# EAGLE design leddriverX3 (EAGLE 9.4.2)
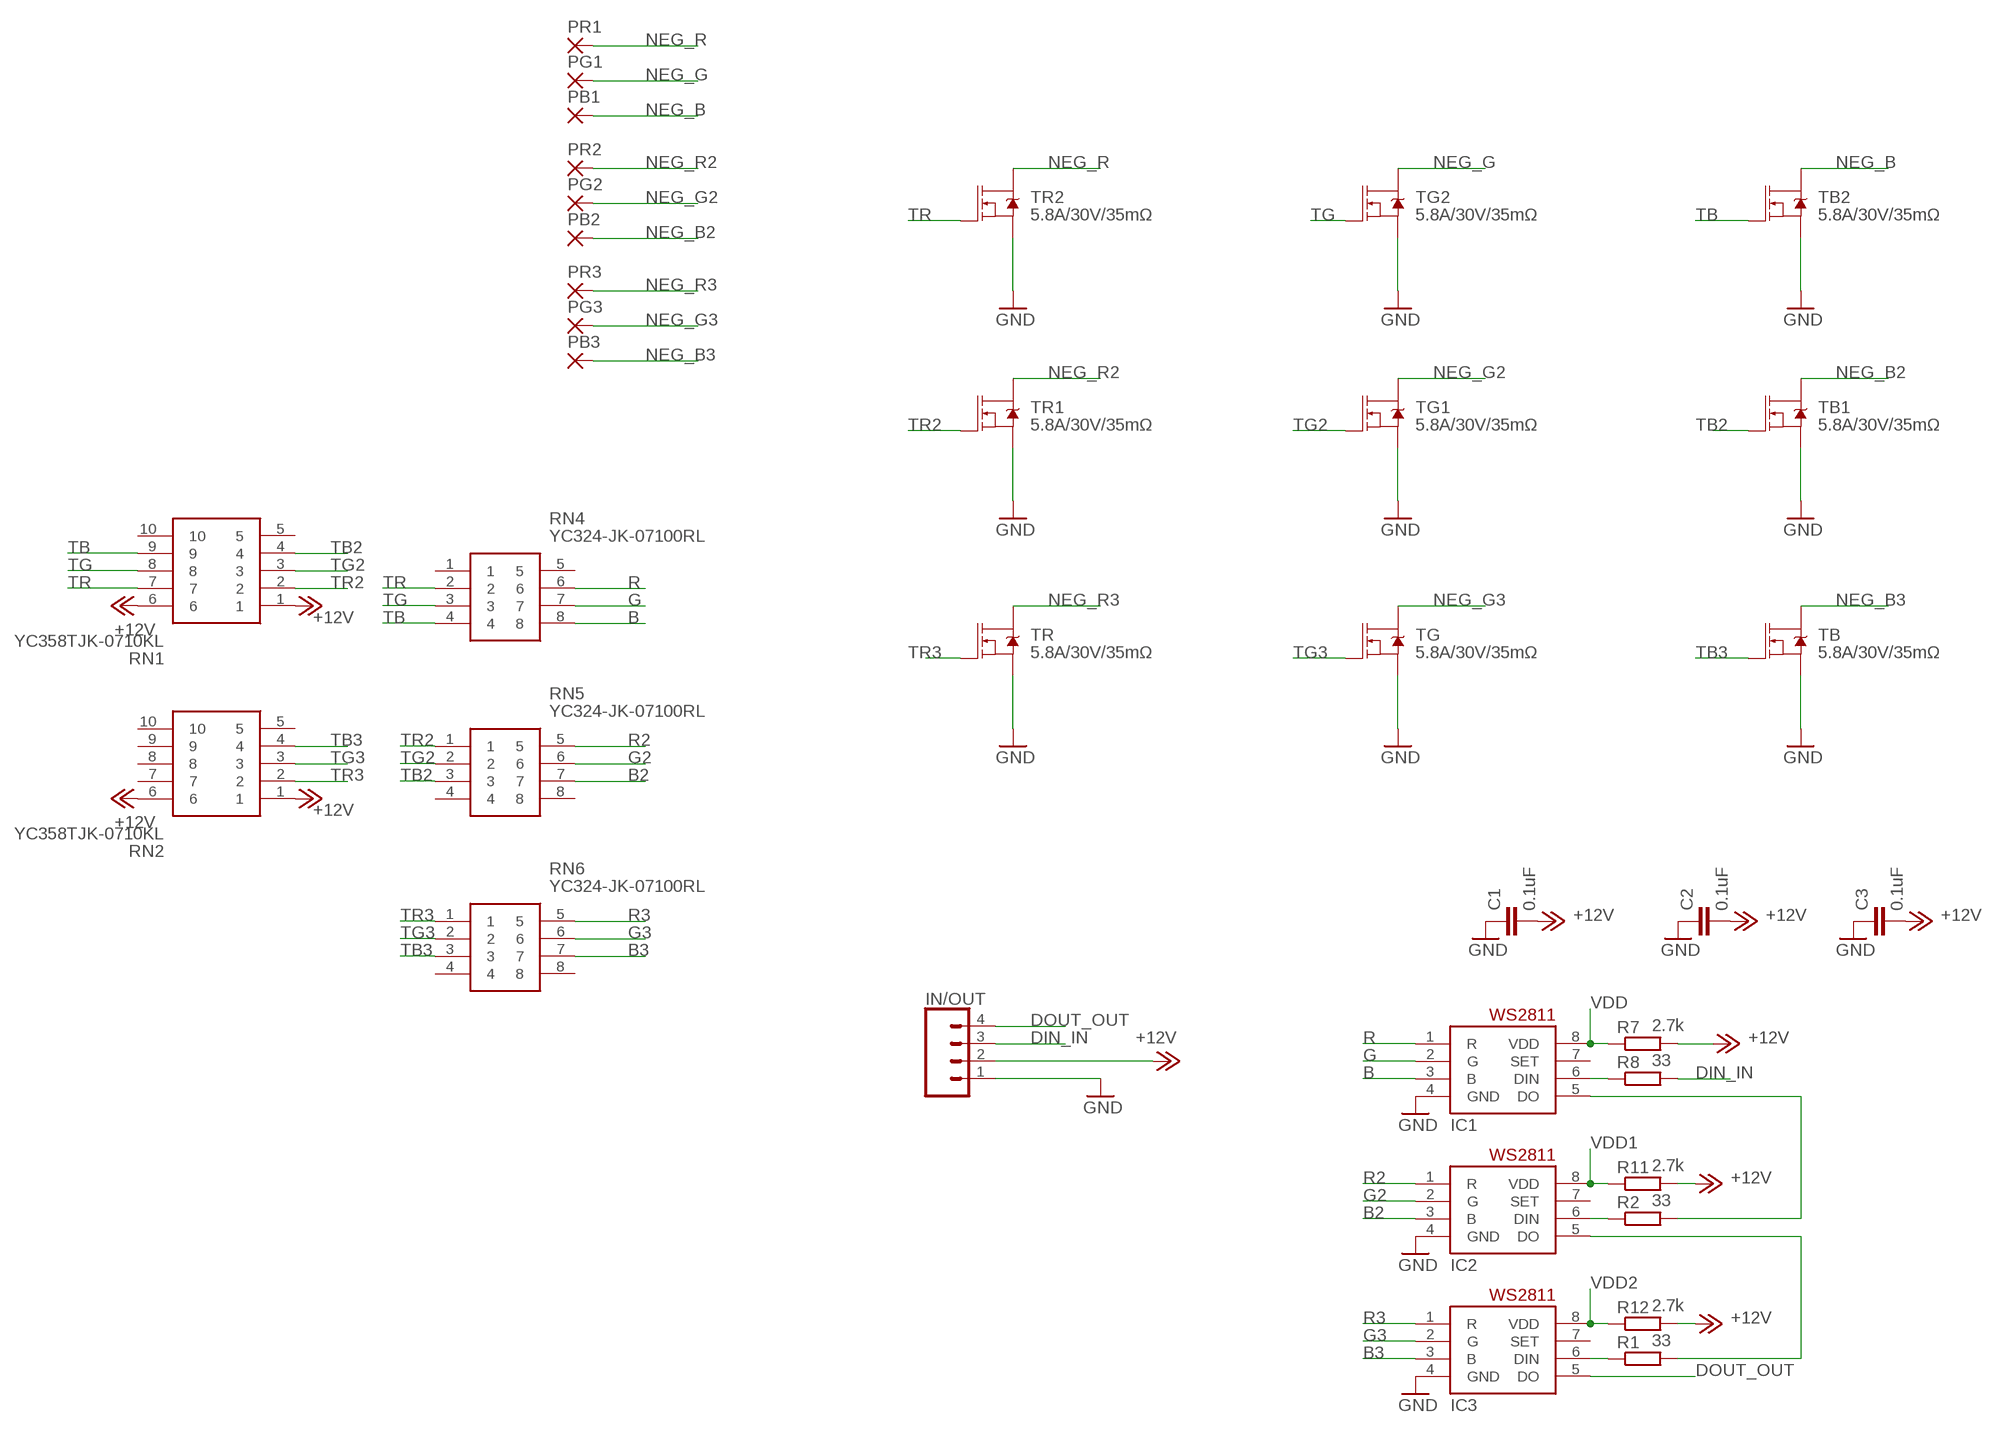
[diagram p0: schematic, sheet 1]

## Parts
C1  0.1uF  C-EUC1206  [C1206]
C2  0.1uF  C-EUC1206  [C1206]
C3  0.1uF  C-EUC1206  [C1206]
IC1  WS2811-SOP8  [SO08-SKINNYPADS]
IC2  WS2811-SOP8  [SO08-SKINNYPADS]
IC3  WS2811-SOP8  [SO08-SKINNYPADS]
IN/OUT  CONN_04LONGPADS  [1X04_LONGPADS]
PB1  3,81/1,4  [3,81/1,4]
PB2  3,81/1,4  [3,81/1,4]
PB3  3,81/1,4  [3,81/1,4]
PG1  3,81/1,4  [3,81/1,4]
PG2  3,81/1,4  [3,81/1,4]
PG3  3,81/1,4  [3,81/1,4]
PR1  3,81/1,4  [3,81/1,4]
PR2  3,81/1,4  [3,81/1,4]
PR3  3,81/1,4  [3,81/1,4]
R1  33  R-EU_R0805  [R0805]
R2  33  R-EU_R0805  [R0805]
R7  2.7k  R-EU_R0805  [R0805]
R8  33  R-EU_R0805  [R0805]
R11  2.7k  R-EU_R0805  [R0805]
R12  2.7k  R-EU_R0805  [R0805]
RN1  YC358TJK-0710KL  [YC358T]
RN2  YC358TJK-0710KL  [YC358T]
RN4  YC324-JK-07100RL  [YC324JK07100RL]
RN5  YC324-JK-07100RL  [YC324JK07100RL]
RN6  YC324-JK-07100RL  [YC324JK07100RL]
TB  5.8A/30V/35mΩ  MOSFET-NCH-AO3404A  [SOT23-3]
TB1  5.8A/30V/35mΩ  MOSFET-NCH-AO3404A  [SOT23-3]
TB2  5.8A/30V/35mΩ  MOSFET-NCH-AO3404A  [SOT23-3]
TG  5.8A/30V/35mΩ  MOSFET-NCH-AO3404A  [SOT23-3]
TG1  5.8A/30V/35mΩ  MOSFET-NCH-AO3404A  [SOT23-3]
TG2  5.8A/30V/35mΩ  MOSFET-NCH-AO3404A  [SOT23-3]
TR  5.8A/30V/35mΩ  MOSFET-NCH-AO3404A  [SOT23-3]
TR1  5.8A/30V/35mΩ  MOSFET-NCH-AO3404A  [SOT23-3]
TR2  5.8A/30V/35mΩ  MOSFET-NCH-AO3404A  [SOT23-3]

## Nets
+12V: C1.2 C2.2 C3.2 IN/OUT.2 R7.2 R11.2 R12.2 RN1.1 RN1.6 RN2.1 RN2.6
B: IC1.3(B) RN4.8
B2: IC2.3(B) RN5.7
B3: IC3.3(B) RN6.7
DIN_IN: IN/OUT.3 R8.2
DOUT_OUT: IC3.5(DO) IN/OUT.4
G: IC1.2(G) RN4.7
G2: IC2.2(G) RN5.6
G3: IC3.2(G) RN6.6
GND: C1.1 C2.1 C3.1 IC1.4(GND) IC2.4(GND) IC3.4(GND) IN/OUT.1 TB1.2(S) TB2.2(S) TB.2(S) TG1.2(S) TG2.2(S) TG.2(S) TR1.2(S) TR2.2(S) TR.2(S)
N$1: IC1.6(DIN) R8.1
N$5: IC1.5(DO) R2.2
N$11: IC2.5(DO) R1.2
N$13: IC3.6(DIN) R1.1
N$14: IC2.6(DIN) R2.1
NEG_B: PB1.1(P) TB2.3(D)
NEG_B2: PB2.1(P) TB1.3(D)
NEG_B3: PB3.1(P) TB.3(D)
NEG_G: PG1.1(P) TG2.3(D)
NEG_G2: PG2.1(P) TG1.3(D)
NEG_G3: PG3.1(P) TG.3(D)
NEG_R: PR1.1(P) TR2.3(D)
NEG_R2: PR2.1(P) TR1.3(D)
NEG_R3: PR3.1(P) TR.3(D)
R: IC1.1(R) RN4.6
R2: IC2.1(R) RN5.5
R3: IC3.1(R) RN6.5
TB: RN1.9 RN4.4 TB2.1(G)
TB2: RN1.4 RN5.3 TB1.1(G)
TB3: RN2.4 RN6.3 TB.1(G)
TG: RN1.8 RN4.3 TG2.1(G)
TG2: RN1.3 RN5.2 TG1.1(G)
TG3: RN2.3 RN6.2 TG.1(G)
TR: RN1.7 RN4.2 TR2.1(G)
TR2: RN1.2 RN5.1 TR1.1(G)
TR3: RN2.2 RN6.1 TR.1(G)
VDD: IC1.8(VDD) R7.1
VDD1: IC2.8(VDD) R11.1
VDD2: IC3.8(VDD) R12.1
Unconnected: IC1.7(SET) IC2.7(SET) IC3.7(SET) RN1.5 RN1.10 RN2.5 RN2.7 RN2.8 RN2.9 RN2.10 RN4.1 RN4.5 RN5.4 RN5.8 RN6.4 RN6.8

## Library data of the parts
C1-C3 = rcl:C-EU: CAPACITOR, European symbol; SPICEPREFIX: C
IC1-IC3 = adafruit_wsled:WS2811
IN/OUT = SparkFun-Connectors:CONN_04: Multi connection point. Often used as Generic Header-pin footprint for 0.1 inch spaced/style header connections On any of the 0.1 inch spaced packages, you can populate with these: Break Away Headers - Straight <https://www.sparkfun.com/products/116> (PRT-00116) Break Away Male Headers - Right Angle <https://www.sparkfun.com/products/553> (PRT-00553) Female Headers <https://www.sparkfun.com/products/115> (PRT-00115) Break Away Headers - Machine Pin <https://www.sparkfun.com/products/117> (PRT-00117) Break Away Female Headers - Swiss Machine Pin <https://www.sparkfun.com/products/743> (PRT-00743) For SCREWTERMINALS and SPRING TERMINALS visit here: Screw Terimnals on SparkFun.com <https://www.sparkfun.com/search/results?term=Screw+Terminals> (5mm/3.5mm/2.54mm spacing) This device is also useful as a general connection point to wire up your design to another part of your project. Our various solder wires solder well into these plated through hole pads. Hook-Up Wire - Assortment (Stranded, 22 AWG) <https://www.sparkfun.com/products/11375> (PRT-11375) Hook-Up Wire - Assortment (Solid Core, 22 AWG) <https://www.sparkfun.com/products/11367> (PRT-11367) View the entire wire category on our website here <https://www.sparkfun.com/categories/141> Special notes: Molex polarized connector foot print use with SKU : PRT-08231 with associated crimp pins and housings. 1MM SMD Version SKU: PRT-10208; PROD_ID: CONN-09696
PB1-PB3 PG1-PG3 PR1-PR3 = wirepad:3,81/1,4: THROUGH-HOLE PAD
R1 R2 R7 R8 R11 R12 = rcl:R-EU_: RESISTOR, European symbol; SPICEPREFIX: R
RN1 RN2 = SamacSys_Parts:YC358TJK-0710KL: Resistor Networks & Arrays 10K 5% CONVEX SQUARE 8X1225 Source: Datasheet <https://componentsearchengine.com/Datasheets/1/YC358TJK-0710KL.pdf>; DESCRIPTION: Resistor Networks & Arrays 10K 5% CONVEX SQUARE 8X1225; HEIGHT: mm; MANUFACTURER_NAME: YAGEO (PHYCOMP); MANUFACTURER_PART_NUMBER: YC358TJK-0710KL; MOUSER_PART_NUMBER: 603-YC358TJK-0710KL; MOUSER_PRICE-STOCK: https://www.mouser.com/Search/Refine.aspx?Keyword=603-YC358TJK-0710KL
RN4-RN6 = SamacSys_Parts:YC324-JK-07100RL: Resistor Networks & Arrays Source: Datasheet <https://componentsearchengine.com/Datasheets/1/YC324-JK-07100RL.pdf>; DESCRIPTION: Resistor Networks & Arrays; HEIGHT: 0.6mm; MANUFACTURER_NAME: YAGEO (PHYCOMP); MANUFACTURER_PART_NUMBER: YC324-JK-07100RL; MOUSER_PART_NUMBER: 603-YC324-JK-07100RL; MOUSER_PRICE-STOCK: https://www.mouser.com/Search/Refine.aspx?Keyword=603-YC324-JK-07100RL
TB TB1 TB2 TG TG1 TG2 TR TR1 TR2 = SparkFun-DiscreteSemi:MOSFET-NCH: N-channel MOSFETs Voltage controlled devices that allow control of high current outputs. SparkFun Products: SparkFun OpenScale <https://www.sparkfun.com/products/13261> SparkFun Digital Sandbox <https://www.sparkfun.com/products/12651> SparkFun Monster Moto Shield <https://www.sparkfun.com/products/10182> SparkFun MOSFET Power Controller <https://www.sparkfun.com/products/11214>; PROD_ID: TRANS-12988

## Board
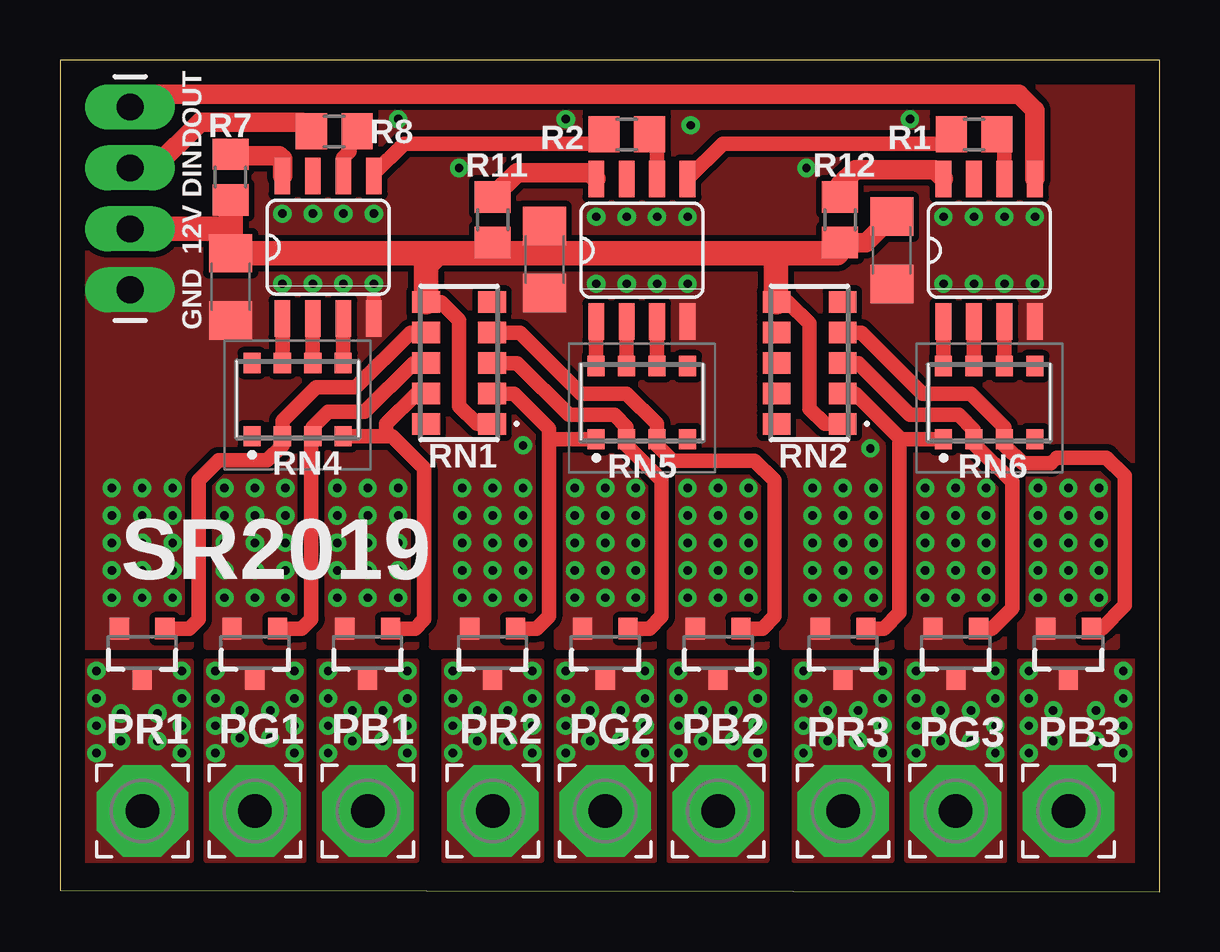
[diagram p1: board, top side]
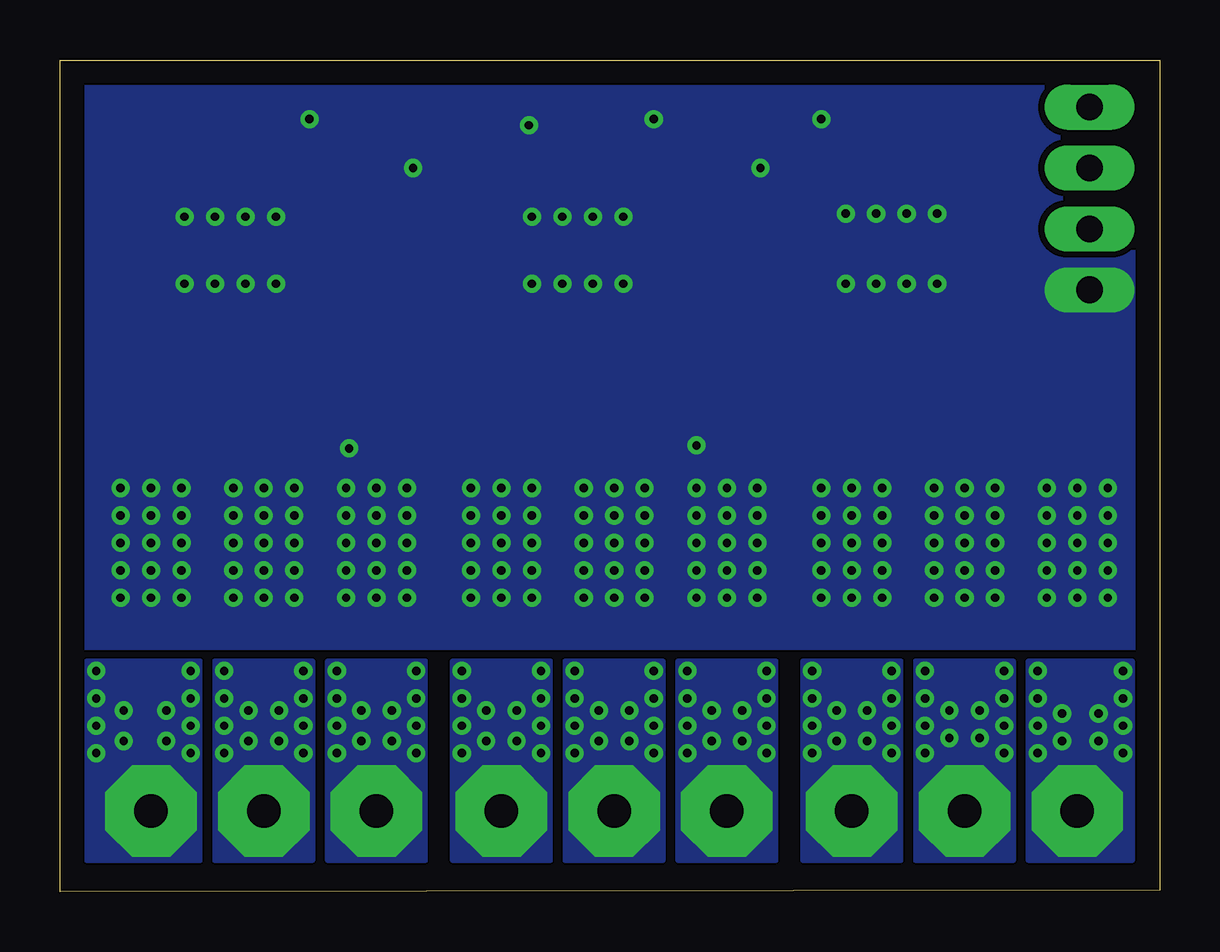
[diagram p2: board, bottom side, seen from below]

Size 45.83 x 34.66 mm. Coordinates in mm from the lower left corner, seen from the top.
Outline: 0,0.06 45.84,0 45.84,34.66 0,34.66 0,0.06
Copper layers (1*16): Top 0.035mm / dielectric 1.5mm / Bottom 0.035mm
Design rules "default *": minimum track width 6mil, minimum drill 0.35mm, track to track 6mil, track to pad 6mil, pad to pad 6mil, via to via 6mil, smd to smd 6mil, copper to edge 40mil, drill to drill 6mil, minimum pad ring 10mil, minimum via ring 8mil, stop-mask expansion 4mil, vias tented up to drill 100mil, thermal gap 10mil

### Footprints (pad centres in the part's own frame; a part is rotated, then mirrored left to right if it is on the bottom)
C1206 = smd 1.6 x 1.8: 1 -1.4,0; 2 1.4,0
SO08-SKINNYPADS = smd 0.66 x 1.524: 1 -1.905,-2.973; 2 -0.635,-2.973; 3 0.635,-2.973; 4 1.905,-2.973; 5 1.905,2.973; 6 0.635,2.973; 7 -0.635,2.973; 8 -1.905,2.973
1X04_LONGPADS = drill 1.118 pad 1.88 long: 1 0,0; 2 2.54,0; 3 5.08,0; 4 7.62,0
3,81/1,4 = drill 1.397 pad 3.81 octagon: 1 0,0
R0805 = smd 1.3 x 1.5: 1 -0.95,0; 2 0.95,0
YC358T = smd 0.9 x 1.15: 1 -2.54,-1.375; 2 -1.27,-1.375; 3 0,-1.375; 4 1.27,-1.375; 5 2.54,-1.375; 6 2.54,1.375; 7 1.27,1.375; 8 0,1.375; 9 -1.27,1.375; 10 -2.54,1.375
YC324JK07100RL = smd 0.71 x 0.85: 1 -1.905,-1.525; 2 -0.635,-1.525; 3 0.635,-1.525; 4 1.905,-1.525; 5 -1.905,1.525; 6 -0.635,1.525; 7 0.635,1.525; 8 1.905,1.525
SOT23-3 = smd 0.8 x 0.9: 1 -0.95,-1; 2 0.95,-1; 3 0,1.1

### Placement (x,y rotation side)
C1  20.19,26.35 90 top
C2  7.11,25.21 90 top
C3  34.67,26.73 90 top
IC1  11.18,26.86 0 top
IC2  24.26,26.73 0 top
IC3  38.73,26.73 0 top
IN/OUT  2.92,25.08 90 top
PB1  12.83,3.37 180 top
PB2  27.43,3.37 0 top
PB3  42.04,3.37 0 top
PG1  8.13,3.37 180 top
PG2  22.73,3.37 0 top
PG3  37.34,3.37 0 top
PR1  3.43,3.37 180 top
PR2  18.03,3.37 0 top
PR3  32.64,3.37 0 top
R1  38.1,31.56 180 top
R2  23.62,31.56 180 top
R7  7.11,29.78 270 top
R8  11.43,31.69 180 top
R11  18.03,28 270 top
R12  32.51,28 270 top
RN1  16.64,22.03 90 top
RN2  31.24,22.03 90 top
RN4  9.91,20.51 0 top
RN5  24.26,20.38 0 top
RN6  38.73,20.38 0 top
TB  42.04,9.97 180 top
TB1  27.43,9.97 180 top
TB2  12.83,9.97 180 top
TG  37.34,9.97 180 top
TG1  22.73,9.97 180 top
TG2  8.13,9.97 180 top
TR  32.64,9.97 180 top
TR1  18.03,9.97 180 top
TR2  3.43,9.97 180 top

### Tracks (layer width: path | path; a pad name or v marks a point on that pad's centre or on a via)
+12V
  Top 0.61: RN1.1 17.38,19.49 16.64,20.23 16.64,23.81 15.88,24.57 RN1.6 | RN2.1 31.88,19.49 31.24,20.13 31.24,23.69 30.35,24.57 RN2.6 | R12.2 32.51,26.73 32.38,26.61
  Top 0.813: C1.2 20.19,26.61 | R11.2 18.03,26.61 | C3.2 33.59,27.05 R12.2 | C2.2 6.99,26.61
  Top 1.016: 15.75,26.61 6.99,26.61 7.11,26.73 7.11,27.62 | 15.75,26.61 18.03,26.61 20.19,26.61 29.84,26.61 | 32.38,26.61 29.84,26.61 | RN2.6 29.84,24.6 29.84,26.61 | RN1.6 15.26,26.12 15.75,26.61 | R7.2 7.11,27.62 | IN/OUT.2 7.11,27.62
B
  Top 0.61: IC1.3 RN4.8
B2
  Top 0.61: IC2.3 RN5.7
B3
  Top 0.61: RN6.7 IC3.3
DIN_IN
  Top 0.813: IN/OUT.3 3.94,30.16 5.84,32.07 10.1,32.07 R8.2
DOUT_OUT
  Top 0.813: IC3.5 40.64,32.58 39.98,33.24 3.46,33.24 IN/OUT.4
G
  Top 0.61: IC1.2 RN4.7
G2
  Top 0.61: IC2.2 RN5.6
G3
  Top 0.61: RN6.6 IC3.2
GND  (via drill 0.35)
  Top 0.61: 13.08,24.7 IC1.4
  other vias: 9.27,28.26 13.08,25.34 9.27,25.34 10.54,25.34 11.81,25.34 22.35,25.34 23.62,25.34 24.89,25.34 26.16,25.34 36.83,25.34 38.1,25.34 39.37,25.34 40.64,25.34 31.11,30.16 10.54,28.26 11.81,28.26 13.08,28.26 22.35,28.13 23.62,28.13 24.89,28.13 26.16,28.13 36.83,28.13 38.1,28.13 39.37,28.13 40.64,28.13 9.4,12.26 8.13,12.26 6.86,12.26 6.86,13.4 6.86,14.54 6.86,15.68 8.13,13.4 8.13,14.54 8.13,15.68 9.4,13.4 9.4,14.54 9.4,15.68 6.86,16.83 8.13,16.83 9.4,16.83 14.1,12.26 12.83,12.26 11.56,12.26 11.56,13.4 11.56,14.54 11.56,15.68 12.83,13.4 12.83,14.54 12.83,15.68 14.1,13.4 14.1,14.54 14.1,15.68 11.56,16.83 12.83,16.83 14.1,16.83 4.7,12.26 3.43,12.26 2.16,12.26 2.16,13.4 2.16,14.54 2.16,15.68 3.43,13.4 3.43,14.54 3.43,15.68 4.7,13.4 4.7,14.54 4.7,15.68 2.16,16.83 3.43,16.83 4.7,16.83 19.3,12.26 18.03,12.26 16.76,12.26 16.76,13.4 16.76,14.54 16.76,15.68 18.03,13.4 18.03,14.54 18.03,15.68 19.3,13.4 19.3,14.54 19.3,15.68 16.76,16.83 18.03,16.83 19.3,16.83 24,12.26 22.73,12.26 21.46,12.26 21.46,13.4 21.46,14.54 21.46,15.68 22.73,13.4 22.73,14.54 22.73,15.68 24,13.4 24,14.54 24,15.68 21.46,16.83 22.73,16.83 24,16.83 28.7,12.26 27.43,12.26 26.16,12.26 26.16,13.4 26.16,14.54 26.16,15.68 27.43,13.4 27.43,14.54 27.43,15.68 28.7,13.4 28.7,14.54 28.7,15.68 26.16,16.83 27.43,16.83 28.7,16.83 33.91,12.26 32.64,12.26 31.37,12.26 31.37,13.4 31.37,14.54 31.37,15.68 32.64,13.4 32.64,14.54 32.64,15.68 33.91,13.4 33.91,14.54 33.91,15.68 31.37,16.83 32.64,16.83 33.91,16.83 38.61,12.26 37.34,12.26 36.07,12.26 36.07,13.4 36.07,14.54 36.07,15.68 37.34,13.4 37.34,14.54 37.34,15.68 38.61,13.4 38.61,14.54 38.61,15.68 36.07,16.83 37.34,16.83 38.61,16.83 43.31,12.26 42.04,12.26 40.77,12.26 40.77,13.4 40.77,14.54 40.77,15.68 42.04,13.4 42.04,14.54 42.04,15.68 43.31,13.4 43.31,14.54 43.31,15.68 40.77,16.83 42.04,16.83 43.31,16.83 19.3,18.61 33.78,18.48 26.29,31.94 35.43,32.19 14.1,32.19 21.08,32.19 16.64,30.16
  pour Top (isolate 0.254, no thermals): 0.63,10.22 5.46,10.22 5.46,18.35 0.63,18.35
  pour Top (isolate 0.254, no thermals): 6.1,10.22 10.16,10.22 10.16,18.35 6.1,18.35
  pour Top (isolate 0.254, no thermals): 10.79,10.22 14.86,10.22 14.86,18.61 10.79,18.61
  pour Top (isolate 0.254, no thermals): 15.49,10.22 20.07,10.22 20.07,18.99 15.49,18.99
  pour Top (isolate 0.254, no thermals): 20.7,10.22 24.77,10.22 24.77,18.73 20.7,18.73
  pour Top (isolate 0.254, no thermals): 25.4,10.22 29.46,10.22 29.46,17.72 25.4,17.72
  pour Top (isolate 0.254, no thermals): 30.1,10.22 34.67,10.22 34.67,18.1 30.1,18.1
  pour Top (isolate 0.254, no thermals): 35.31,10.22 39.37,10.22 39.37,18.35 35.31,18.35
  pour Top (isolate 0.254, no thermals): 40,10.22 44.07,10.22 44.07,17.97 40,17.97
  pour Top (isolate 0.254, no thermals): 0.89,34.35 45.47,34.35 45.47,17.34 0.89,17.34
  pour Bottom (isolate 0.254, no thermals): 0.38,34.35 45.47,34.35 45.47,10.22 0.38,10.22
N$1
  Top 0.61: R8.1 12.25,31.69 12.06,31.5 12.06,30.85 11.81,30.6 IC1.6
N$5
  Top 0.61: IC1.5 13.08,29.91 14.35,31.18 22.29,31.18 R2.2
N$11
  Top 0.61: IC2.5 27.64,31.18 36.77,31.18 R1.2
N$13
  Top 0.61: IC3.6 39.37,31.24 R1.1
N$14
  Top 0.61: IC2.6 24.89,31.24 R2.1
NEG_B  (via drill 0.35)
  other vias: 11.18,9.21 11.18,8.06 11.18,6.92 11.18,5.78 14.48,9.21 14.48,8.06 14.48,6.92 14.48,5.78 12.19,7.56 13.46,7.56 13.46,6.29 12.19,6.29
  pour Top (no thermals): 10.79,1.33 14.86,1.33 14.86,9.59 10.79,9.59
  pour Bottom (no thermals): 14.86,9.59 14.86,1.33 10.79,1.33 10.79,9.59 14.73,9.59
NEG_B2  (via drill 0.35)
  other vias: 25.78,9.21 25.78,8.06 25.78,6.92 25.78,5.78 29.08,9.21 29.08,8.06 29.08,6.92 29.08,5.78 26.8,7.56 28.07,7.56 28.07,6.29 26.8,6.29
  pour Top (no thermals): 25.4,1.33 29.46,1.33 29.46,9.59 25.4,9.59
  pour Bottom (no thermals): 29.46,9.59 29.46,1.33 25.4,1.33 25.4,9.59
NEG_B3  (via drill 0.35)
  other vias: 40.39,9.21 40.39,8.06 40.39,6.92 40.39,5.78 44.32,9.21 44.32,8.06 44.32,6.92 44.32,5.78 41.4,7.56 43.18,7.56 43.18,6.29 41.4,6.29
  pour Top (no thermals): 40,1.33 44.96,1.33 44.96,9.59 40,9.59
  pour Bottom (no thermals): 40,9.59 44.7,9.59 44.7,1.33 40,1.33
NEG_G  (via drill 0.35)
  other vias: 6.48,9.21 6.48,8.06 6.48,6.92 6.48,5.78 9.78,9.21 9.78,8.06 9.78,6.92 9.78,5.78 7.49,7.56 8.76,7.56 7.49,6.41 8.76,6.41
  pour Top (no thermals): 6.1,1.33 10.16,1.33 10.16,9.59 6.1,9.59
  pour Bottom (no thermals): 10.16,9.59 10.16,1.33 6.1,1.33 6.1,9.59
NEG_G2  (via drill 0.35)
  other vias: 21.08,9.21 21.08,8.06 21.08,6.92 21.08,5.78 24.38,9.21 24.38,8.06 24.38,6.92 24.38,5.78 22.1,7.56 23.37,7.56 23.37,6.29 22.1,6.29
  pour Top (no thermals): 20.7,1.33 24.77,1.33 24.77,9.59 20.7,9.59
  pour Bottom (no thermals): 24.77,9.59 24.77,1.33 20.7,1.33 20.7,9.59
NEG_G3  (via drill 0.35)
  other vias: 35.69,9.21 35.69,8.06 35.69,6.92 35.69,5.78 38.99,9.21 38.99,8.06 38.99,6.92 38.99,5.78 36.7,7.56 37.97,7.56 37.97,6.29 36.7,6.29
  pour Top (no thermals): 35.31,1.33 39.37,1.33 39.37,9.59 35.31,9.59
  pour Bottom (no thermals): 39.37,9.59 39.37,1.33 35.31,1.33 35.31,9.59
NEG_R  (via drill 0.35)
  other vias: 1.52,9.21 1.52,8.06 1.52,6.92 5.08,9.21 5.08,8.06 5.08,6.92 5.08,5.78 1.52,5.78 2.54,7.43 4.06,7.43 2.54,6.29 4.06,6.29
  pour Top (no thermals): 0.76,1.33 5.46,1.33 5.46,9.59 0.76,9.59
  pour Bottom (no thermals): 5.46,9.59 5.46,1.33 1.14,1.33 1.14,9.59
NEG_R2  (via drill 0.35)
  other vias: 16.38,9.21 16.38,8.06 16.38,6.92 16.38,5.78 19.68,9.21 19.68,8.06 19.68,6.92 19.68,5.78 17.4,7.56 18.67,7.56 18.67,6.29 17.4,6.29
  pour Top (no thermals): 16,1.33 20.07,1.33 20.07,9.59 16,9.59
  pour Bottom (no thermals): 20.07,9.59 20.07,1.33 16,1.33 16,9.59
NEG_R3  (via drill 0.35)
  other vias: 30.99,9.21 30.99,8.06 30.99,6.92 30.99,5.78 34.29,9.21 34.29,8.06 34.29,6.92 34.29,5.78 32,7.56 33.27,7.56 33.27,6.29 32,6.29
  pour Top (no thermals): 30.61,1.33 34.67,1.33 34.67,9.59 30.61,9.59
  pour Bottom (no thermals): 34.67,9.59 34.67,1.33 30.61,1.33 30.61,9.59
R
  Top 0.61: RN4.6 IC1.1
R2
  Top 0.61: IC2.1 RN5.5
R3
  Top 0.61: RN6.5 IC3.1
TB
  Top 0.61: RN4.4 13.59,18.99 | 13.59,18.99 13.84,18.99 15.17,17.66 15.17,11.35 14.79,10.97 TB2.1 | RN1.9 14.86,20.76 13.59,19.49 13.59,18.99
TB2
  Top 0.61: TB1.1 29.27,10.97 29.78,11.48 29.78,17.15 28.96,17.97 25.53,17.97 24.89,18.61 RN5.3 24.89,19.49 23.62,20.76 21.72,20.76 19.18,23.3 RN1.4
TB3
  Top 0.61: TB.1 43.42,10.97 44.39,11.94 44.39,17.34 43.62,18.1 41.56,18.1 41.31,17.85 40.13,17.85 39.37,18.61 RN6.3 39.37,19.37 37.97,20.76 35.94,20.76 33.4,23.3 RN2.4
TG
  Top 0.61: TG2.1 10.08,10.97 10.48,11.37 10.48,18.92 RN4.3 10.54,19.37 11.18,20 12.7,20 14.73,22.03 RN1.8
TG2
  Top 0.61: TG1.1 24.57,10.97 25.08,11.48 25.08,17.15 23.62,18.6 RN5.2 23.62,19.37 23.11,19.88 21.21,19.88 19.05,22.03 RN1.3
TG3
  Top 0.61: TG.1 38.85,10.97 39.69,11.81 39.69,17.08 38.1,18.67 RN6.2 38.1,19.24 37.46,19.88 35.43,19.88 33.27,22.03 RN2.3
TR
  Top 0.61: TR2.1 5.4,10.97 5.78,11.35 5.78,17.14 6.61,17.98 8.64,17.98 9.27,18.61 RN4.2 9.27,19.62 10.67,21.02 12.32,21.02 14.6,23.3 RN1.7
TR2
  Top 0.61: TR1.1 19.87,10.97 20.38,11.48 20.38,18.73 | RN5.1 20.51,18.86 20.38,18.73 | RN1.2 18.92,20.76 20.38,19.31 20.38,18.73
TR3
  Top 0.61: TR.1 34.34,10.97 34.99,11.62 34.99,18.73 | RN6.1 35.11,18.86 34.99,18.73 | RN2.2 33.15,20.76 34.99,18.92 34.99,18.73
VDD
  Top 0.813: IC1.8 9.27,30.54 9.14,30.67 7.17,30.67 R7.1
VDD1
  Top 0.813: IC2.8 22.09,29.97 19.05,29.97 R11.1
VDD2
  Top 0.813: IC3.8 36.44,30.1 33.15,30.1 32.51,29.46 R12.1

### Text on the board
tNames: DOUT | DIN | 12V | GND | SR2019